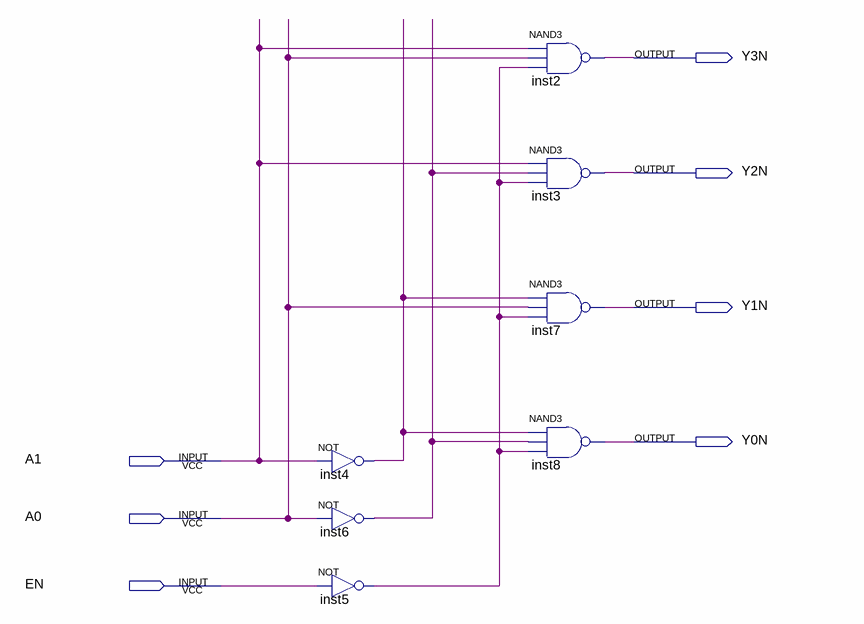
[diagram p0: schematic sheet]
// Quartus schematic 24yima.bdf as structural Verilog: 7 symbols, 7 pins
module \24yima  (
  input  A1,
  input  A0,
  input  EN,
  output Y3N,
  output Y2N,
  output Y1N,
  output Y0N
);

  wire inst4_out, inst5_out, inst6_out;

  not inst4 (inst4_out, A1);
  not inst6 (inst6_out, A0);
  not inst5 (inst5_out, EN);
  nand inst2 (Y3N, A1, A0, inst5_out);
  nand inst3 (Y2N, A1, inst6_out, inst5_out);
  nand inst7 (Y1N, inst4_out, A0, inst5_out);
  nand inst8 (Y0N, inst4_out, inst6_out, inst5_out);
endmodule
